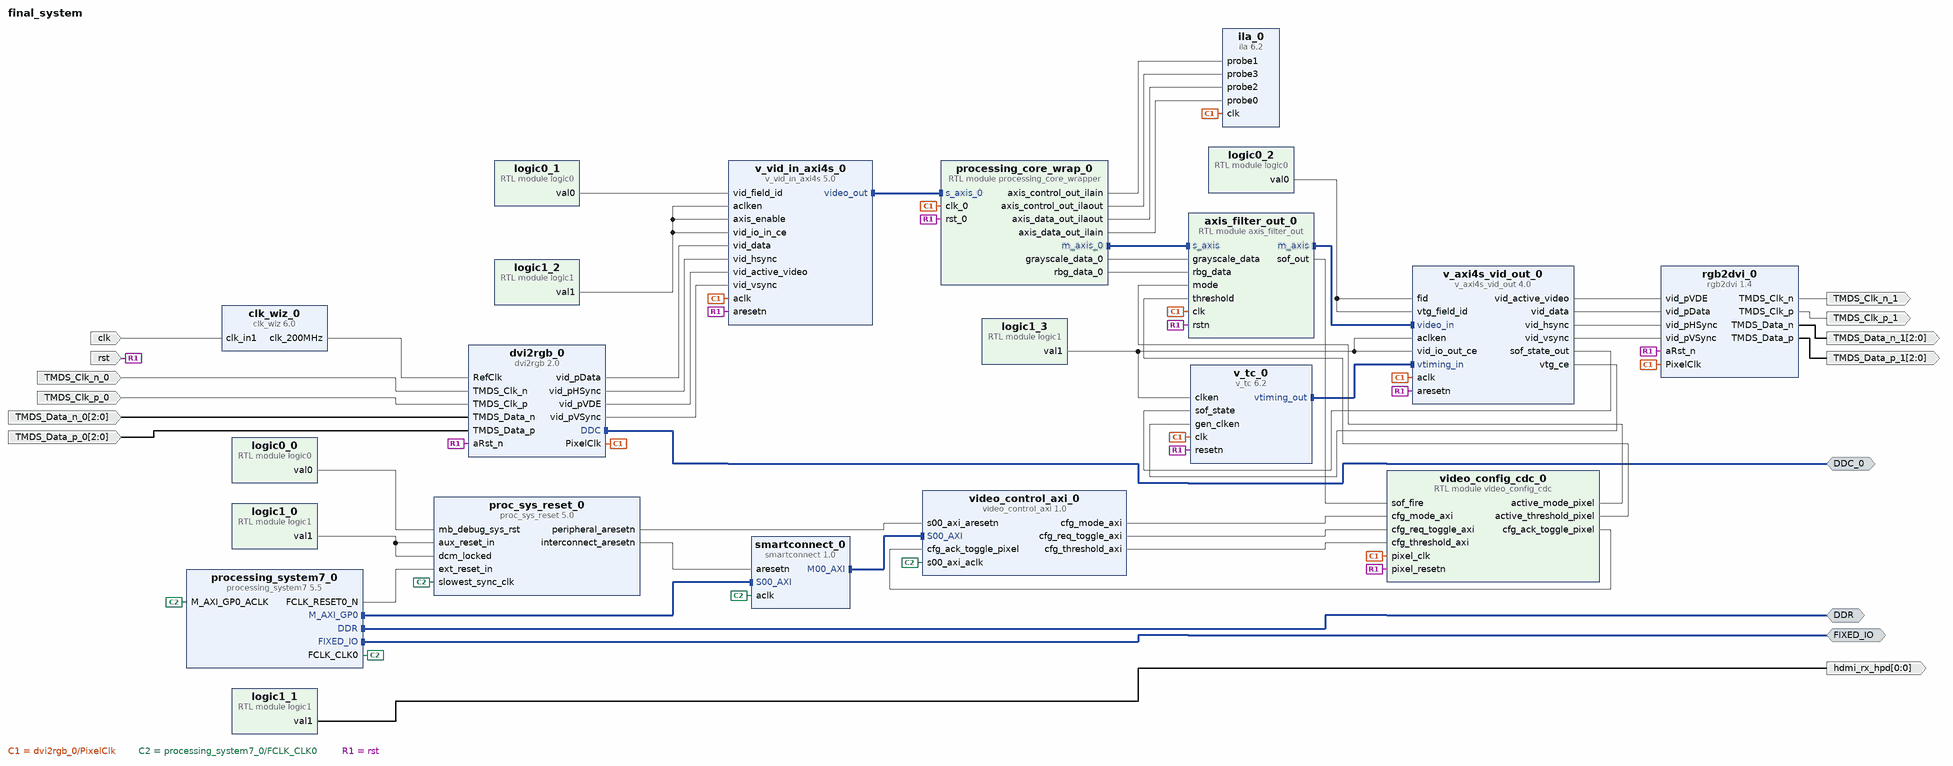
[diagram p0: block diagram of the top level]
# Vivado block design final_system, xc7z020clg400-1, Vivado 2026.1
create_bd_design final_system

create_bd_intf_port -mode Master -vlnv xilinx.com:interface:iic_rtl:1.0 DDC_0
create_bd_intf_port -mode Master -vlnv xilinx.com:interface:ddrx_rtl:1.0 DDR
create_bd_intf_port -mode Master -vlnv xilinx.com:display_processing_system7:fixedio_rtl:1.0 FIXED_IO
create_bd_port -dir I -type clk TMDS_Clk_p_0
create_bd_port -dir I -type clk TMDS_Clk_n_0
create_bd_port -dir I -from 2 -to 0 TMDS_Data_p_0
create_bd_port -dir I -from 2 -to 0 TMDS_Data_n_0
create_bd_port -dir O -type clk TMDS_Clk_p_1
create_bd_port -dir O -type clk TMDS_Clk_n_1
create_bd_port -dir O -from 2 -to 0 TMDS_Data_p_1
create_bd_port -dir O -from 2 -to 0 TMDS_Data_n_1
create_bd_port -dir I -type clk clk
create_bd_port -dir I rst
create_bd_port -dir O -from 0 -to 0 hdmi_rx_hpd

create_bd_cell -type ip -vlnv digilentinc.com:ip:dvi2rgb:2.0 dvi2rgb_0
set_property -dict [list \
  CONFIG.kAddBUFG true \
  CONFIG.kClkRange 1 \
  CONFIG.kEdidFileName dgl_1080p_cea.data \
  CONFIG.kEmulateDDC true \
  CONFIG.kRstActiveHigh false \
] [get_bd_cells dvi2rgb_0]
create_bd_cell -type ip -vlnv digilentinc.com:ip:rgb2dvi:1.4 rgb2dvi_0
set_property -dict {CONFIG.kClkRange 1 CONFIG.kGenerateSerialClk true CONFIG.kRstActiveHigh false} [get_bd_cells rgb2dvi_0]
create_bd_cell -type ip -vlnv xilinx.com:ip:clk_wiz:6.0 clk_wiz_0
set_property -dict [list \
  CONFIG.CLKIN1_JITTER_PS 100.0 \
  CONFIG.CLKOUT1_JITTER 114.829 \
  CONFIG.CLKOUT1_PHASE_ERROR 98.575 \
  CONFIG.CLKOUT1_REQUESTED_OUT_FREQ 200 \
  CONFIG.CLK_IN1_BOARD_INTERFACE sys_clock \
  CONFIG.CLK_OUT1_PORT clk_200MHz \
  CONFIG.MMCM_CLKFBOUT_MULT_F 8.000 \
  CONFIG.MMCM_CLKIN1_PERIOD 8.000 \
  CONFIG.MMCM_CLKOUT0_DIVIDE_F 5.000 \
  CONFIG.USE_LOCKED false \
  CONFIG.USE_RESET false \
] [get_bd_cells clk_wiz_0]
create_bd_cell -type ip -vlnv xilinx.com:ip:v_axi4s_vid_out:4.0 v_axi4s_vid_out_0
create_bd_cell -type ip -vlnv xilinx.com:ip:v_vid_in_axi4s:5.0 v_vid_in_axi4s_0
create_bd_cell -type ip -vlnv xilinx.com:ip:v_tc:6.2 v_tc_0
set_property -dict [list \
  CONFIG.HAS_AXI4_LITE false \
  CONFIG.SYNC_EN false \
  CONFIG.VIDEO_MODE 1080p \
  CONFIG.enable_detection false \
] [get_bd_cells v_tc_0]
create_bd_cell -type ip -vlnv xilinx.com:ip:smartconnect:1.0 smartconnect_0
set_property -dict {CONFIG.NUM_SI 1} [get_bd_cells smartconnect_0]
create_bd_cell -type ip -vlnv xilinx.com:ip:proc_sys_reset:5.0 proc_sys_reset_0
create_bd_cell -type ip -vlnv xilinx.com:ip:processing_system7:5.5 processing_system7_0
set_property -dict [list \
  CONFIG.PCW_APU_PERIPHERAL_FREQMHZ 650 \
  CONFIG.PCW_CRYSTAL_PERIPHERAL_FREQMHZ 50 \
  CONFIG.PCW_ENET0_ENET0_IO {MIO 16 .. 27} \
  CONFIG.PCW_ENET0_GRP_MDIO_ENABLE 1 \
  CONFIG.PCW_ENET0_GRP_MDIO_IO {MIO 52 .. 53} \
  CONFIG.PCW_ENET0_PERIPHERAL_ENABLE 1 \
  CONFIG.PCW_ENET0_RESET_ENABLE 1 \
  CONFIG.PCW_ENET0_RESET_IO {MIO 9} \
  CONFIG.PCW_ENET_RESET_ENABLE 1 \
  CONFIG.PCW_ENET_RESET_SELECT {Share reset pin} \
  CONFIG.PCW_FPGA0_PERIPHERAL_FREQMHZ 100 \
  CONFIG.PCW_FPGA1_PERIPHERAL_FREQMHZ 50 \
  CONFIG.PCW_GPIO_MIO_GPIO_ENABLE 1 \
  CONFIG.PCW_GPIO_MIO_GPIO_IO MIO \
  CONFIG.PCW_I2C_RESET_ENABLE 1 \
  CONFIG.PCW_M_AXI_GP0_FREQMHZ 10 \
  CONFIG.PCW_PERIPHERAL_BOARD_PRESET part0 \
  CONFIG.PCW_PRESET_BANK1_VOLTAGE {LVCMOS 1.8V} \
  CONFIG.PCW_QSPI_GRP_FBCLK_ENABLE 1 \
  CONFIG.PCW_QSPI_GRP_FBCLK_IO {MIO 8} \
  CONFIG.PCW_QSPI_GRP_SINGLE_SS_ENABLE 1 \
  CONFIG.PCW_QSPI_GRP_SINGLE_SS_IO {MIO 1 .. 6} \
  CONFIG.PCW_QSPI_PERIPHERAL_ENABLE 1 \
  CONFIG.PCW_QSPI_QSPI_IO {MIO 1 .. 6} \
  CONFIG.PCW_SD0_GRP_CD_ENABLE 1 \
  CONFIG.PCW_SD0_GRP_CD_IO {MIO 47} \
  CONFIG.PCW_SD0_GRP_WP_ENABLE 0 \
  CONFIG.PCW_SD0_PERIPHERAL_ENABLE 1 \
  CONFIG.PCW_SD0_SD0_IO {MIO 40 .. 45} \
  CONFIG.PCW_SDIO_PERIPHERAL_FREQMHZ 50 \
  CONFIG.PCW_SINGLE_QSPI_DATA_MODE x4 \
  CONFIG.PCW_UART0_PERIPHERAL_ENABLE 1 \
  CONFIG.PCW_UART0_UART0_IO {MIO 14 .. 15} \
  CONFIG.PCW_UART1_PERIPHERAL_ENABLE 0 \
  CONFIG.PCW_UART_PERIPHERAL_FREQMHZ 100 \
  CONFIG.PCW_UIPARAM_DDR_BUS_WIDTH {16 Bit} \
  CONFIG.PCW_UIPARAM_DDR_FREQ_MHZ 525 \
  CONFIG.PCW_UIPARAM_DDR_PARTNO {MT41J256M16 RE-125} \
  CONFIG.PCW_USB0_PERIPHERAL_ENABLE 1 \
  CONFIG.PCW_USB0_RESET_ENABLE 1 \
  CONFIG.PCW_USB0_RESET_IO {MIO 46} \
  CONFIG.PCW_USB0_USB0_IO {MIO 28 .. 39} \
  CONFIG.PCW_USB_RESET_ENABLE 1 \
  CONFIG.PCW_USB_RESET_SELECT {Share reset pin} \
] [get_bd_cells processing_system7_0]
# 481 more settings of processing_system7_0 are not shown: defaults, MIO pin electricals, DDR timing, and values the tool derives
create_bd_cell -type module -reference axis_filter_out axis_filter_out_0
create_bd_cell -type module -reference video_config_cdc video_config_cdc_0
create_bd_cell -type ip -vlnv xilinx.com:user:video_control_axi:1.0 video_control_axi_0
create_bd_cell -type module -reference logic0 logic0_0
create_bd_cell -type module -reference logic1 logic1_0
create_bd_cell -type module -reference logic1 logic1_1
create_bd_cell -type module -reference logic1 logic1_2
create_bd_cell -type module -reference logic1 logic1_3
create_bd_cell -type module -reference logic0 logic0_1
create_bd_cell -type module -reference logic0 logic0_2
create_bd_cell -type ip -vlnv xilinx.com:ip:ila:6.2 ila_0
set_property -dict [list \
  CONFIG.ALL_PROBE_SAME_MU true \
  CONFIG.C_ADV_TRIGGER true \
  CONFIG.C_DATA_DEPTH 8192 \
  CONFIG.C_MONITOR_TYPE Native \
  CONFIG.C_NUM_OF_PROBES 4 \
  CONFIG.C_PROBE1_WIDTH 4 \
  CONFIG.C_PROBE2_WIDTH 24 \
  CONFIG.C_PROBE3_WIDTH 4 \
] [get_bd_cells ila_0]
create_bd_cell -type module -reference processing_core_wrapper processing_core_wrap_0

# ---- connections ----

connect_bd_intf_net [get_bd_intf_pins axis_filter_out_0/m_axis] [get_bd_intf_pins v_axi4s_vid_out_0/video_in]
connect_bd_intf_net [get_bd_intf_ports DDC_0] [get_bd_intf_pins dvi2rgb_0/DDC]
connect_bd_intf_net [get_bd_intf_pins processing_core_wrap_0/m_axis_0] [get_bd_intf_pins axis_filter_out_0/s_axis]
connect_bd_intf_net [get_bd_intf_ports DDR] [get_bd_intf_pins processing_system7_0/DDR]
connect_bd_intf_net [get_bd_intf_ports FIXED_IO] [get_bd_intf_pins processing_system7_0/FIXED_IO]
connect_bd_intf_net [get_bd_intf_pins processing_system7_0/M_AXI_GP0] [get_bd_intf_pins smartconnect_0/S00_AXI]
connect_bd_intf_net [get_bd_intf_pins smartconnect_0/M00_AXI] [get_bd_intf_pins video_control_axi_0/S00_AXI]
connect_bd_intf_net [get_bd_intf_pins v_tc_0/vtiming_out] [get_bd_intf_pins v_axi4s_vid_out_0/vtiming_in]
connect_bd_intf_net [get_bd_intf_pins v_vid_in_axi4s_0/video_out] [get_bd_intf_pins processing_core_wrap_0/s_axis_0]
connect_bd_net -net TMDS_Clk_n_0_1 [get_bd_ports TMDS_Clk_n_0] [get_bd_pins dvi2rgb_0/TMDS_Clk_n]
connect_bd_net -net TMDS_Clk_p_0_1 [get_bd_ports TMDS_Clk_p_0] [get_bd_pins dvi2rgb_0/TMDS_Clk_p]
connect_bd_net -net TMDS_Data_n_0_1 [get_bd_ports TMDS_Data_n_0] [get_bd_pins dvi2rgb_0/TMDS_Data_n]
connect_bd_net -net TMDS_Data_p_0_1 [get_bd_ports TMDS_Data_p_0] [get_bd_pins dvi2rgb_0/TMDS_Data_p]
connect_bd_net -net axis_filter_out_0_frame_start [get_bd_pins axis_filter_out_0/sof_out] [get_bd_pins video_config_cdc_0/sof_fire]
connect_bd_net -net clk_in1_0_1 [get_bd_ports clk] [get_bd_pins clk_wiz_0/clk_in1]
connect_bd_net [get_bd_pins clk_wiz_0/clk_200MHz] [get_bd_pins dvi2rgb_0/RefClk]
connect_bd_net [get_bd_pins dvi2rgb_0/PixelClk] \
  [get_bd_pins v_axi4s_vid_out_0/aclk] [get_bd_pins v_tc_0/clk] [get_bd_pins v_vid_in_axi4s_0/aclk] \
  [get_bd_pins rgb2dvi_0/PixelClk] [get_bd_pins axis_filter_out_0/clk] [get_bd_pins video_config_cdc_0/pixel_clk] \
  [get_bd_pins ila_0/clk] [get_bd_pins processing_core_wrap_0/clk_0]
connect_bd_net [get_bd_pins dvi2rgb_0/vid_pData] [get_bd_pins v_vid_in_axi4s_0/vid_data]
connect_bd_net [get_bd_pins dvi2rgb_0/vid_pHSync] [get_bd_pins v_vid_in_axi4s_0/vid_hsync]
connect_bd_net [get_bd_pins dvi2rgb_0/vid_pVDE] [get_bd_pins v_vid_in_axi4s_0/vid_active_video]
connect_bd_net [get_bd_pins dvi2rgb_0/vid_pVSync] [get_bd_pins v_vid_in_axi4s_0/vid_vsync]
connect_bd_net [get_bd_pins logic0_0/val0] [get_bd_pins proc_sys_reset_0/mb_debug_sys_rst]
connect_bd_net [get_bd_pins logic0_1/val0] [get_bd_pins v_vid_in_axi4s_0/vid_field_id]
connect_bd_net [get_bd_pins logic0_2/val0] [get_bd_pins v_axi4s_vid_out_0/fid] [get_bd_pins v_axi4s_vid_out_0/vtg_field_id]
connect_bd_net [get_bd_pins logic1_1/val1] [get_bd_ports hdmi_rx_hpd]
connect_bd_net [get_bd_pins logic1_2/val1] \
  [get_bd_pins v_vid_in_axi4s_0/vid_io_in_ce] [get_bd_pins v_vid_in_axi4s_0/aclken] \
  [get_bd_pins v_vid_in_axi4s_0/axis_enable]
connect_bd_net [get_bd_pins logic1_3/val1] \
  [get_bd_pins v_tc_0/clken] [get_bd_pins v_axi4s_vid_out_0/aclken] [get_bd_pins v_axi4s_vid_out_0/vid_io_out_ce]
connect_bd_net [get_bd_pins proc_sys_reset_0/interconnect_aresetn] [get_bd_pins smartconnect_0/aresetn]
connect_bd_net [get_bd_pins proc_sys_reset_0/peripheral_aresetn] [get_bd_pins video_control_axi_0/s00_axi_aresetn]
connect_bd_net -net processing_core_wrap_0_axis_control_ILA_input [get_bd_pins processing_core_wrap_0/axis_control_out_ilain] \
  [get_bd_pins ila_0/probe1]
connect_bd_net -net processing_core_wrap_0_axis_control_ILA_output [get_bd_pins processing_core_wrap_0/axis_control_out_ilaout] \
  [get_bd_pins ila_0/probe3]
connect_bd_net -net processing_core_wrap_0_axis_data_ILA_output [get_bd_pins processing_core_wrap_0/axis_data_out_ilaout] [get_bd_pins ila_0/probe2]
connect_bd_net [get_bd_pins processing_core_wrap_0/axis_data_out_ilain] [get_bd_pins ila_0/probe0]
connect_bd_net [get_bd_pins processing_core_wrap_0/grayscale_data_0] [get_bd_pins axis_filter_out_0/grayscale_data]
connect_bd_net [get_bd_pins processing_core_wrap_0/rbg_data_0] [get_bd_pins axis_filter_out_0/rbg_data]
connect_bd_net [get_bd_pins processing_system7_0/FCLK_CLK0] \
  [get_bd_pins smartconnect_0/aclk] [get_bd_pins processing_system7_0/M_AXI_GP0_ACLK] \
  [get_bd_pins proc_sys_reset_0/slowest_sync_clk] [get_bd_pins video_control_axi_0/s00_axi_aclk]
connect_bd_net [get_bd_pins processing_system7_0/FCLK_RESET0_N] [get_bd_pins proc_sys_reset_0/ext_reset_in]
connect_bd_net [get_bd_pins rgb2dvi_0/TMDS_Clk_n] [get_bd_ports TMDS_Clk_n_1]
connect_bd_net [get_bd_pins rgb2dvi_0/TMDS_Clk_p] [get_bd_ports TMDS_Clk_p_1]
connect_bd_net [get_bd_pins rgb2dvi_0/TMDS_Data_n] [get_bd_ports TMDS_Data_n_1]
connect_bd_net [get_bd_pins rgb2dvi_0/TMDS_Data_p] [get_bd_ports TMDS_Data_p_1]
connect_bd_net [get_bd_ports rst] \
  [get_bd_pins v_axi4s_vid_out_0/aresetn] [get_bd_pins v_tc_0/resetn] [get_bd_pins v_vid_in_axi4s_0/aresetn] \
  [get_bd_pins dvi2rgb_0/aRst_n] [get_bd_pins rgb2dvi_0/aRst_n] [get_bd_pins video_config_cdc_0/pixel_resetn] \
  [get_bd_pins axis_filter_out_0/rstn] [get_bd_pins processing_core_wrap_0/rst_0]
connect_bd_net [get_bd_pins v_axi4s_vid_out_0/sof_state_out] [get_bd_pins v_tc_0/sof_state]
connect_bd_net [get_bd_pins v_axi4s_vid_out_0/vid_active_video] [get_bd_pins rgb2dvi_0/vid_pVDE]
connect_bd_net [get_bd_pins v_axi4s_vid_out_0/vid_data] [get_bd_pins rgb2dvi_0/vid_pData]
connect_bd_net [get_bd_pins v_axi4s_vid_out_0/vid_hsync] [get_bd_pins rgb2dvi_0/vid_pHSync]
connect_bd_net [get_bd_pins v_axi4s_vid_out_0/vid_vsync] [get_bd_pins rgb2dvi_0/vid_pVSync]
connect_bd_net [get_bd_pins v_axi4s_vid_out_0/vtg_ce] [get_bd_pins v_tc_0/gen_clken]
connect_bd_net [get_bd_pins video_config_cdc_0/active_mode_pixel] [get_bd_pins axis_filter_out_0/mode]
connect_bd_net [get_bd_pins video_config_cdc_0/active_threshold_pixel] [get_bd_pins axis_filter_out_0/threshold]
connect_bd_net [get_bd_pins video_config_cdc_0/cfg_ack_toggle_pixel] [get_bd_pins video_control_axi_0/cfg_ack_toggle_pixel]
connect_bd_net [get_bd_pins video_control_axi_0/cfg_mode_axi] [get_bd_pins video_config_cdc_0/cfg_mode_axi]
connect_bd_net [get_bd_pins video_control_axi_0/cfg_req_toggle_axi] [get_bd_pins video_config_cdc_0/cfg_req_toggle_axi]
connect_bd_net [get_bd_pins video_control_axi_0/cfg_threshold_axi] [get_bd_pins video_config_cdc_0/cfg_threshold_axi]
connect_bd_net -net xlconstant_3_val1_dout [get_bd_pins logic1_0/val1] \
  [get_bd_pins proc_sys_reset_0/aux_reset_in] [get_bd_pins proc_sys_reset_0/dcm_locked]

# ---- address map ----
assign_bd_address -offset 0x43C00000 -range 64K -target_address_space [get_bd_addr_spaces processing_system7_0/Data] [get_bd_addr_segs video_control_axi_0/S00_AXI/S00_AXI_reg]

validate_bd_design
save_bd_design
